# Altium schematic sheet PCI Express_16765X6890_98PIN_Low profile.schdoc: PCI Express x8 Top Sheet
size A3; SheetNumber: 1; SheetTotal: 2
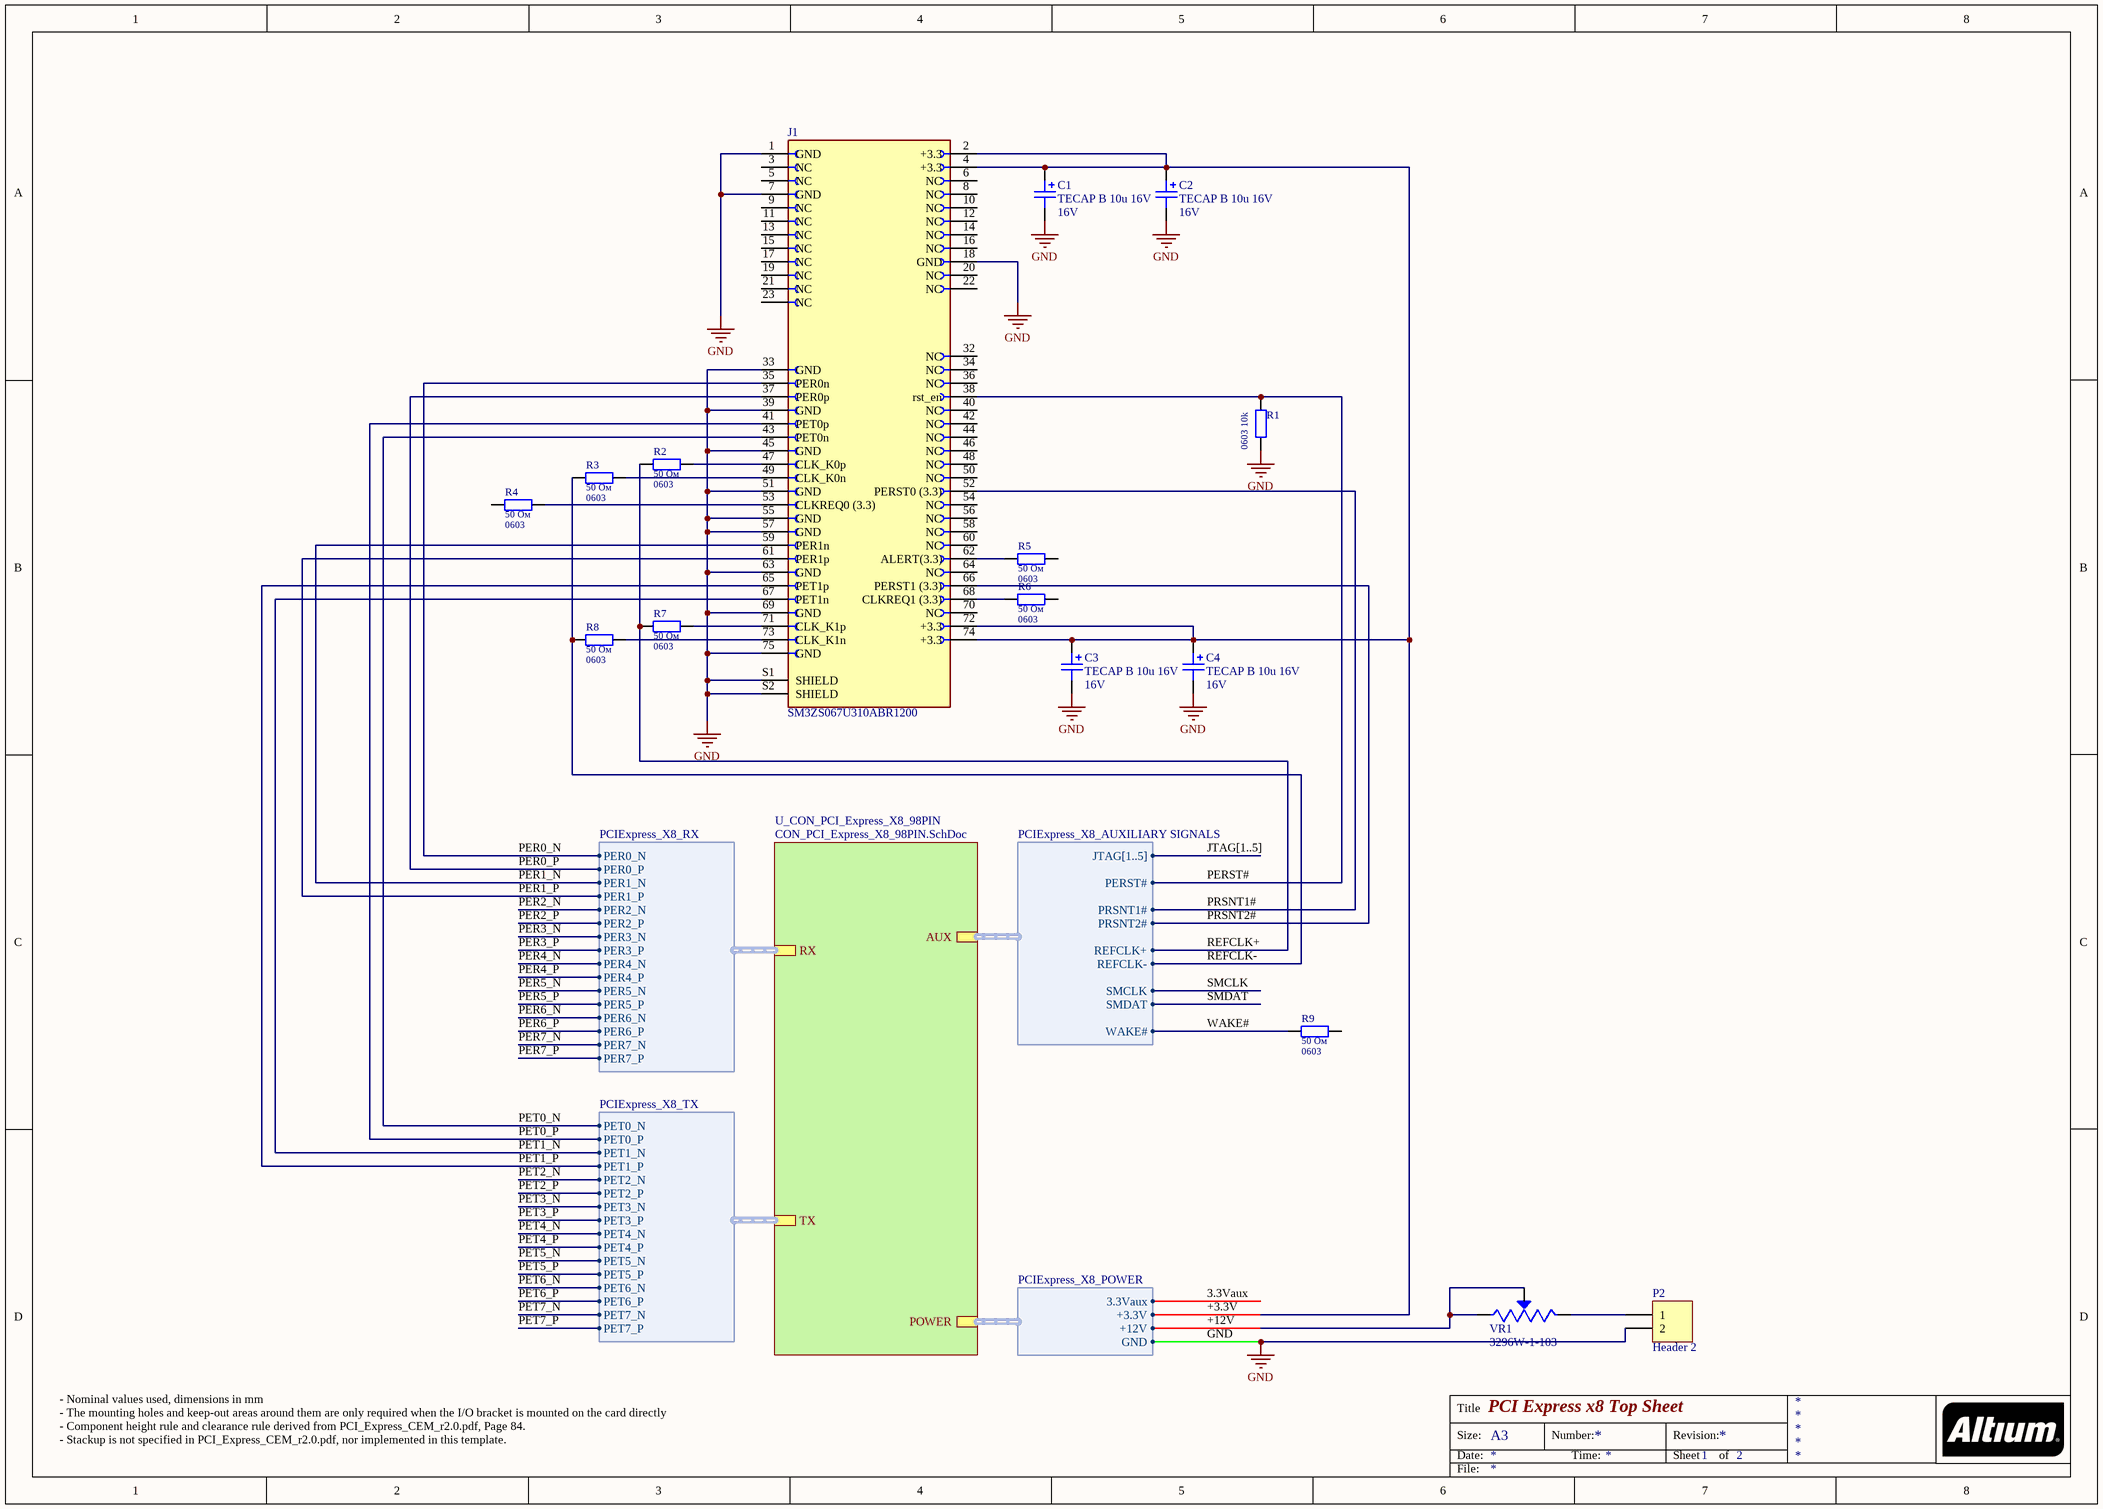
[diagram p0: PCI Express_16765X6890_98PIN_Low profile.schdoc]

## Parts
C1  Voltage: 16V  [TECAP B]  (hidden comment: TECAP B 10u 16V)
C2  Voltage: 16V  [TECAP B]  (hidden comment: TECAP B 10u 16V)
C3  Voltage: 16V  [TECAP B]  (hidden comment: TECAP B 10u 16V)
C4  Voltage: 16V  [TECAP B]  (hidden comment: TECAP B 10u 16V)
J1  SM3ZS067U310ABR1200  [JAE_SM3ZS067U310ABR1200]
P2  Header 2  [HDR1X2]
R1  0603 10k  [RESCHIP0603]
R2  Type: 0603  [RESCHIP0603]  (hidden comment: 50 Ом)
R3  Type: 0603  [RESCHIP0603]  (hidden comment: 50 Ом)
R4  Type: 0603  [RESCHIP0603]  (hidden comment: 50 Ом)
R5  Type: 0603  [RESCHIP0603]  (hidden comment: 50 Ом)
R6  Type: 0603  [RESCHIP0603]  (hidden comment: 50 Ом)
R7  Type: 0603  [RESCHIP0603]  (hidden comment: 50 Ом)
R8  Type: 0603  [RESCHIP0603]  (hidden comment: 50 Ом)
R9  Type: 0603  [RESCHIP0603]  (hidden comment: 50 Ом)
VR1  3296W-1-103  [TRIM_3296W-1-103]

## Sub-sheets
U_CON_PCI_Express_X8_98PIN = CON_PCI_Express_X8_98PIN.SchDoc: POWER (harness PCIExpress_X8_POWER), AUX (harness PCIExpress_X8_AUXILIARY SIGNALS), RX (harness PCIExpress_X8_RX), TX (harness PCIExpress_X8_TX)

## Harnesses
PCIExpress_X8_RX: PER0_N, PER0_P, PER1_N, PER1_P, PER2_N, PER2_P, PER3_N, PER3_P, PER4_N, PER4_P, PER5_N, PER5_P, PER6_N, PER6_P, PER7_N, PER7_P
PCIExpress_X8_TX: PET0_N, PET0_P, PET1_N, PET1_P, PET2_N, PET2_P, PET3_N, PET3_P, PET4_N, PET4_P, PET5_N, PET5_P, PET6_N, PET6_P, PET7_N, PET7_P
PCIExpress_X8_POWER: +3.3V, +12V, GND, 3.3Vaux
PCIExpress_X8_AUXILIARY SIGNALS: JTAG[1..5], PERST#, PRSNT1#, PRSNT2#, REFCLK+, REFCLK-, SMCLK, SMDAT, WAKE#

## Nets
GND: C1.2 C2.2 C3.2 C4.2 J1.1(GND) J1.7(GND) J1.18(GND) J1.33(GND) J1.39(GND) J1.45(GND) J1.51(GND) J1.55(GND) J1.57(GND) J1.63(GND) J1.69(GND) J1.75(GND) J1.S1(SHIELD) J1.S2(SHIELD) P2.2 R1.2 ; sheet U_CON_PCI_Express_X8_98PIN/POWER.GND
3.3Vaux: sheet U_CON_PCI_Express_X8_98PIN/POWER.3.3Vaux
+3.3V: C1.1 C2.1 C3.1 C4.1 J1.2(+3.3) J1.4(+3.3) J1.72(+3.3) J1.74(+3.3) ; sheet U_CON_PCI_Express_X8_98PIN/POWER.+3.3V
+12V: VR1.1(CCW) VR1.2(WIPER) ; sheet U_CON_PCI_Express_X8_98PIN/POWER.+12V
PER0_N: J1.35(PER0n) ; sheet U_CON_PCI_Express_X8_98PIN/RX.PER0_N
PER0_P: J1.37(PER0p) ; sheet U_CON_PCI_Express_X8_98PIN/RX.PER0_P
PER1_N: J1.59(PER1n) ; sheet U_CON_PCI_Express_X8_98PIN/RX.PER1_N
PER1_P: J1.61(PER1p) ; sheet U_CON_PCI_Express_X8_98PIN/RX.PER1_P
PER2_N: sheet U_CON_PCI_Express_X8_98PIN/RX.PER2_N
PER2_P: sheet U_CON_PCI_Express_X8_98PIN/RX.PER2_P
PER3_N: sheet U_CON_PCI_Express_X8_98PIN/RX.PER3_N
PER3_P: sheet U_CON_PCI_Express_X8_98PIN/RX.PER3_P
PER4_N: sheet U_CON_PCI_Express_X8_98PIN/RX.PER4_N
PER4_P: sheet U_CON_PCI_Express_X8_98PIN/RX.PER4_P
PER5_N: sheet U_CON_PCI_Express_X8_98PIN/RX.PER5_N
PER5_P: sheet U_CON_PCI_Express_X8_98PIN/RX.PER5_P
PER6_N: sheet U_CON_PCI_Express_X8_98PIN/RX.PER6_N
PER6_P: sheet U_CON_PCI_Express_X8_98PIN/RX.PER6_P
PER7_N: sheet U_CON_PCI_Express_X8_98PIN/RX.PER7_N
PER7_P: sheet U_CON_PCI_Express_X8_98PIN/RX.PER7_P
PERST#: J1.38(rst_en) R1.1 ; sheet U_CON_PCI_Express_X8_98PIN/AUX.PERST#
PET0_N: J1.43(PET0n) ; sheet U_CON_PCI_Express_X8_98PIN/TX.PET0_N
PET0_P: J1.41(PET0p) ; sheet U_CON_PCI_Express_X8_98PIN/TX.PET0_P
PET1_N: J1.67(PET1n) ; sheet U_CON_PCI_Express_X8_98PIN/TX.PET1_N
PET1_P: J1.65(PET1p) ; sheet U_CON_PCI_Express_X8_98PIN/TX.PET1_P
PET2_N: sheet U_CON_PCI_Express_X8_98PIN/TX.PET2_N
PET2_P: sheet U_CON_PCI_Express_X8_98PIN/TX.PET2_P
PET3_N: sheet U_CON_PCI_Express_X8_98PIN/TX.PET3_N
PET3_P: sheet U_CON_PCI_Express_X8_98PIN/TX.PET3_P
PET4_N: sheet U_CON_PCI_Express_X8_98PIN/TX.PET4_N
PET4_P: sheet U_CON_PCI_Express_X8_98PIN/TX.PET4_P
PET5_N: sheet U_CON_PCI_Express_X8_98PIN/TX.PET5_N
PET5_P: sheet U_CON_PCI_Express_X8_98PIN/TX.PET5_P
PET6_N: sheet U_CON_PCI_Express_X8_98PIN/TX.PET6_N
PET6_P: sheet U_CON_PCI_Express_X8_98PIN/TX.PET6_P
PET7_N: sheet U_CON_PCI_Express_X8_98PIN/TX.PET7_N
PET7_P: sheet U_CON_PCI_Express_X8_98PIN/TX.PET7_P
PRSNT1#: J1.52(PERST0_(3.3)) ; sheet U_CON_PCI_Express_X8_98PIN/AUX.PRSNT1#
PRSNT2#: J1.66(PERST1_(3.3)) ; sheet U_CON_PCI_Express_X8_98PIN/AUX.PRSNT2#
REFCLK+: R2.1 R7.1 ; sheet U_CON_PCI_Express_X8_98PIN/AUX.REFCLK+
REFCLK-: R3.1 R8.1 ; sheet U_CON_PCI_Express_X8_98PIN/AUX.REFCLK-
SMCLK: sheet U_CON_PCI_Express_X8_98PIN/AUX.SMCLK
SMDAT: sheet U_CON_PCI_Express_X8_98PIN/AUX.SMDAT
WAKE#: R9.1 ; sheet U_CON_PCI_Express_X8_98PIN/AUX.WAKE#
NetJ1_47: J1.47(CLK_K0p) R2.2
NetJ1_49: J1.49(CLK_K0n) R3.2
NetJ1_53: J1.53(CLKREQ0_(3.3)) R4.2
NetJ1_62: J1.62(ALERT(3.3)) R5.1
NetJ1_68: J1.68(CLKREQ1_(3.3)) R6.1
NetJ1_71: J1.71(CLK_K1p) R7.2
NetJ1_73: J1.73(CLK_K1n) R8.2
NetP2_1: P2.1 VR1.3(CW)

Not connected (* = marked no-connect by the designer): J1 3(NC) 5(NC) 6(NC) 8(NC) 9(NC) 10(NC) 11(NC) 12(NC) 13(NC) 14(NC) 15(NC) 16(NC) 17(NC) 19(NC) 20(NC) 21(NC) 22(NC) 23(NC) 32(NC) 34(NC) 36(NC) 40(NC) 42(NC) 44(NC) 46(NC) 48(NC) 50(NC) 54(NC) 56(NC) 58(NC) 60(NC) 64(NC) 70(NC); R4 1; R5 2; R6 2; R9 2

## Buses and harness runs
bus JTAG[1..5]

## Notes on the sheet
- - Nominal values used, dimensions in mm
  - The mounting holes and keep-out areas around them are only required when the I/O bracket is mounted on the card directly
  - Component height rule and clearance rule derived from PCI_Express_CEM_r2.0.pdf, Page 84.
  - Stackup is not specified in PCI_Express_CEM_r2.0.pdf, nor implemented in this template.
- Title
- Size:
- Date:
- A3
- Number:
- Time:
- Revision:
- Sheet
- of
- File:

## Library data of the parts
C1-C4 = Cap T: Solid Tantalum Surface Mount Capacitors; Value: TECAP B 10u 16V; Type: TECAP B
J1 = SM3ZS067U310ABR1200: 67 Position Female Connector M.2 (NGFF) Mini Card Gold 0.020 (0.50mm); MF: JAE Electronics; Availability: Warning; MP: SM3ZS067U310ABR1200; SnapEDA_Link: https://www.snapeda.com/parts/SM3ZS067U310ABR1200/JAE%20Electronics/view-part/652226/?ref=snap; Purchase-URL: https://pricing.snapeda.com/search/part/SM3ZS067U310ABR1200/?ref=eda; Package: None; Check_prices: https://www.snapeda.com/parts/SM3ZS067U310ABR1200/JAE%20Electronics/view-part/652226/?ref=eda; Value: *; Price: None
P2 = Header 2: Header, 2-Pin; LatestRevisionDate: 17-Jul-2002; LatestRevisionNote: Re-released for DXP Platform.; Publisher: Altium Limited
R1 = Res: Resistor; Body: 0603; Class: Электронные компоненты; Installation: SMD; Ordering_Information: 0603, 10k, 5%; Power_W: 0,065; SubClass: Резисторы; Tolerance_Percent: 5; Value: 0603 10k; Pins: 2
R2-R9 = Res: Резистор SMD R0603; Tolerance: %; PWR: Value; Value: 50 Ом
VR1 = 3296W-1-103: 10 kOhms 0,5W, 1 / 2W PC Pinos atravÃ©s de orifÃ­cio e aparador de potenciÃ´metro Cermet 25 Ajuste superior; MF: Bourns; Check_prices: https://www.snapeda.com/parts/3296W-1-103/Bourns/view-part/421595/?ref=eda; SnapEDA_Link: https://www.snapeda.com/parts/3296W-1-103/Bourns/view-part/421595/?ref=snap; Price: None; MP: 3296W-1-103; Value: *; Availability: Warning; Package: SOT-23-5 Bourns; Purchase-URL: https://pricing.snapeda.com/search/part/3296W-1-103/?ref=eda